# Altium schematic sheet 04-LED-YELLOW.SchDoc: Yellow LEDs
size A; Revision: A; SheetNumber: 4; SheetTotal: 10; ECE315_Project_Name: ECE315 F23 Wack-A-Mole; ImagePath: 4
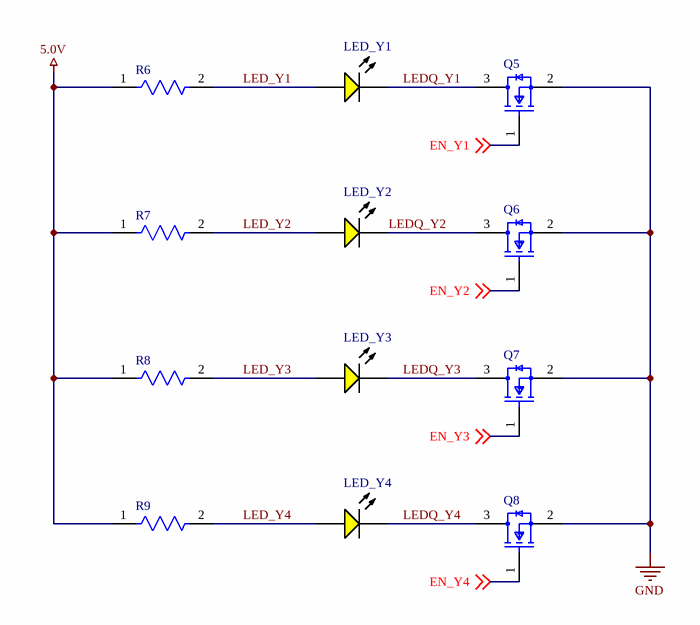
[diagram p0: 04-LED-YELLOW.SchDoc]

## Parts
LED_Y1  SML-LX1206YC-TR  [LUMX-SML-LX1206YC-TR_V]  (value not drawn)
LED_Y2  SML-LX1206YC-TR  [LUMX-SML-LX1206YC-TR_V]  (value not drawn)
LED_Y3  SML-LX1206YC-TR  [LUMX-SML-LX1206YC-TR_V]  (value not drawn)
LED_Y4  SML-LX1206YC-TR  [LUMX-SML-LX1206YC-TR_V]  (value not drawn)
Q5  2N7002-7-F  [FP-SOT23-MFG]  (value not drawn)
Q6  2N7002-7-F  [FP-SOT23-MFG]  (value not drawn)
Q7  2N7002-7-F  [FP-SOT23-MFG]  (value not drawn)
Q8  2N7002-7-F  [FP-SOT23-MFG]  (value not drawn)
R6  CRCW1206330RFKEA  [FP-CRCW1206-e3-IPC_A]  (value not drawn)
R7  CRCW1206330RFKEA  [FP-CRCW1206-e3-IPC_A]  (value not drawn)
R8  CRCW1206330RFKEA  [FP-CRCW1206-e3-IPC_A]  (value not drawn)
R9  CRCW1206330RFKEA  [FP-CRCW1206-e3-IPC_A]  (value not drawn)

## Nets
5.0V: R6.1 R7.1 R8.1 R9.1
GND: Q5.2(S) Q6.2(S) Q7.2(S) Q8.2(S)
EN_Y1: Q5.1(G) ; off-sheet EN_Y1
EN_Y2: Q6.1(G) ; off-sheet EN_Y2
EN_Y3: Q7.1(G) ; off-sheet EN_Y3
EN_Y4: Q8.1(G) ; off-sheet EN_Y4
LED_Y1: LED_Y1.1(A) R6.2
LED_Y2: LED_Y2.1(A) R7.2
LED_Y3: LED_Y3.1(A) R8.2
LED_Y4: LED_Y4.1(A) R9.2
LEDQ_Y1: LED_Y1.2(K) Q5.3(D)
LEDQ_Y2: LED_Y2.2(K) Q6.3(D)
LEDQ_Y3: LED_Y3.2(K) Q7.3(D)
LEDQ_Y4: LED_Y4.2(K) Q8.3(D)

## Notes on the sheet
- Title:
- Size:
- A
- Project
- Rev:
- Sheet:
- of
- College of Engineering
- 1415 Engineering Drive
- Madison, WI 53706

## Library data of the parts
LED_Y1-LED_Y4 = CMP-2000-07124-1: Yellow LED, Water Clear Len, 585 nm, 2.1 V, -40 to 85 degC, 2-Pin SMD, RoHS, Tape and Reel; Manufacturer: Lumex; Product Training Modules: LEDsBenefitsofCustomLEDandLCDTechnology; Millicandela Rating: 6mcd; Catalog Drawings: SML-LX1206SeriesTopSML-LX1206SeriesSideSML-LX1206SeriesBottomSML-LX1206SeriesFootprint; Wavelength - Peak: 585nm; Other Names: 67-1358-2LU60357TRSMLLX1206YCTR; Lens Style/Size: RectanglewithFlatTop; Current - Test: 20mA; Lens Color: Colorless; Viewing Angle: 160°; Voltage - Forward (Vf) (Typ): 2.1V; Online Catalog: SML-LX1206RectanglewithFlatTop1206PackageLEDs; Mounting Type: SurfaceMount; Package Description: 2-Pin Surface Mount Device, Body 3.2 x 1.5 mm; Datasheet Version: Rev. K, 08/2012; Features: -; Color: Yellow; RoHS Information: RoHSCertofCompliance; Package Reference: SML-LX1206YC-TR; Supplier Device Package: 1206; Standard Package: 3,000; Series: -; Wavelength - Dominant: -; Package / Case: 1206(3216Metric); Mounting Technology: SurfaceMount; Height (Max): 1.10mm; Lens Transparency: Clear; Datasheet URL: http://www.lumex.com/content/files/ProductAttachment/SML-LX1206YC-TR.pdf; Family: LEDIndication-Discrete; Manufacturer URL: http://www.lumexinstruments.com/; Packaging: Tape&Reel(TR); Category: Optoelectronics; Size / Dimension: 3.20mmLx1.60mmW
Q5-Q8 = CMP-2000-04929-2: MOSFET N-CH 60V 115MA SOT23-3; Turn-On Delay Time: 7ns; Turn-Off Delay Time: 11ns; Drain to Source Resistance: 7.5R; Rise Time: 3ns; Drain to Source Breakdown Voltage: 70V; Input Capacitance: 50pF; Number of Elements: 1; Power Dissipation: 540mW; Max Power Dissipation: 300mW; Fall Time: 5.6ns; Gate to Source Voltage (Vgs): 20V; Threshold Voltage: 2.5V; Element Configuration: Single; Termination: SMD/SMT; Weight: 0.000282oz; Radiation Hardening: No; Max Operating Temperature: 150°C; On-State Resistance: 7.5R; Mount: Surface Mount; Current Rating: 115mA; Contact Plating: Tin; Lead Free: Lead Free; Min Operating Temperature: -55°C; Number of Pins: 3; REACH SVHC: No SVHC; Drain to Source Voltage (Vdss): 60V; Width: 1.3mm; Package Quantity: 3000; Length: 2.9mm; Case/Package: SOT-23; Number of Channels: 1; Dual Supply Voltage: 60V; Packaging: Tape and Reel; Height: 1mm; Voltage Rating (DC): 60V; Nominal Vgs: 2.5V; Continuous Drain Current (ID): 115mA; Voltage: 60V; Rds On Max: 7.5R
R6-R9 = CMP-2003-02098-2: RES Thick Film, 330Ω, 1%, 0.25W, 100ppm/°C, 1206; Voltage Rating: 200V; Resistance: 330R; Max Power Dissipation: 250mW; Height: 0.55mm; Mount: Surface Mount; Min Operating Temperature: -55°C; Depth: 1.6mm; Features: Automotive AEC-Q200; Voltage Rating (DC): 200V; Military Standard: Not; Packaging: Tape and Reel; Composition: Thick Film; Contact Plating: Tin; Case Code (Imperial): 1206; Case/Package: 1206; Number of Terminations: 2; Length: 3.2mm; Lead Free: Lead Free; Tolerance: 1%; Temperature Coefficient: 100ppm/°C; Case Code (Metric): 3216; Width: 1.6mm; Weight: 0.000353oz; Termination: SMD/SMT; Radiation Hardening: No; Package Quantity: 10; Power Rating: 250mW; Max Operating Temperature: 155°C